# EAGLE design ESP32_VGA_Pocket (EAGLE 6.3)
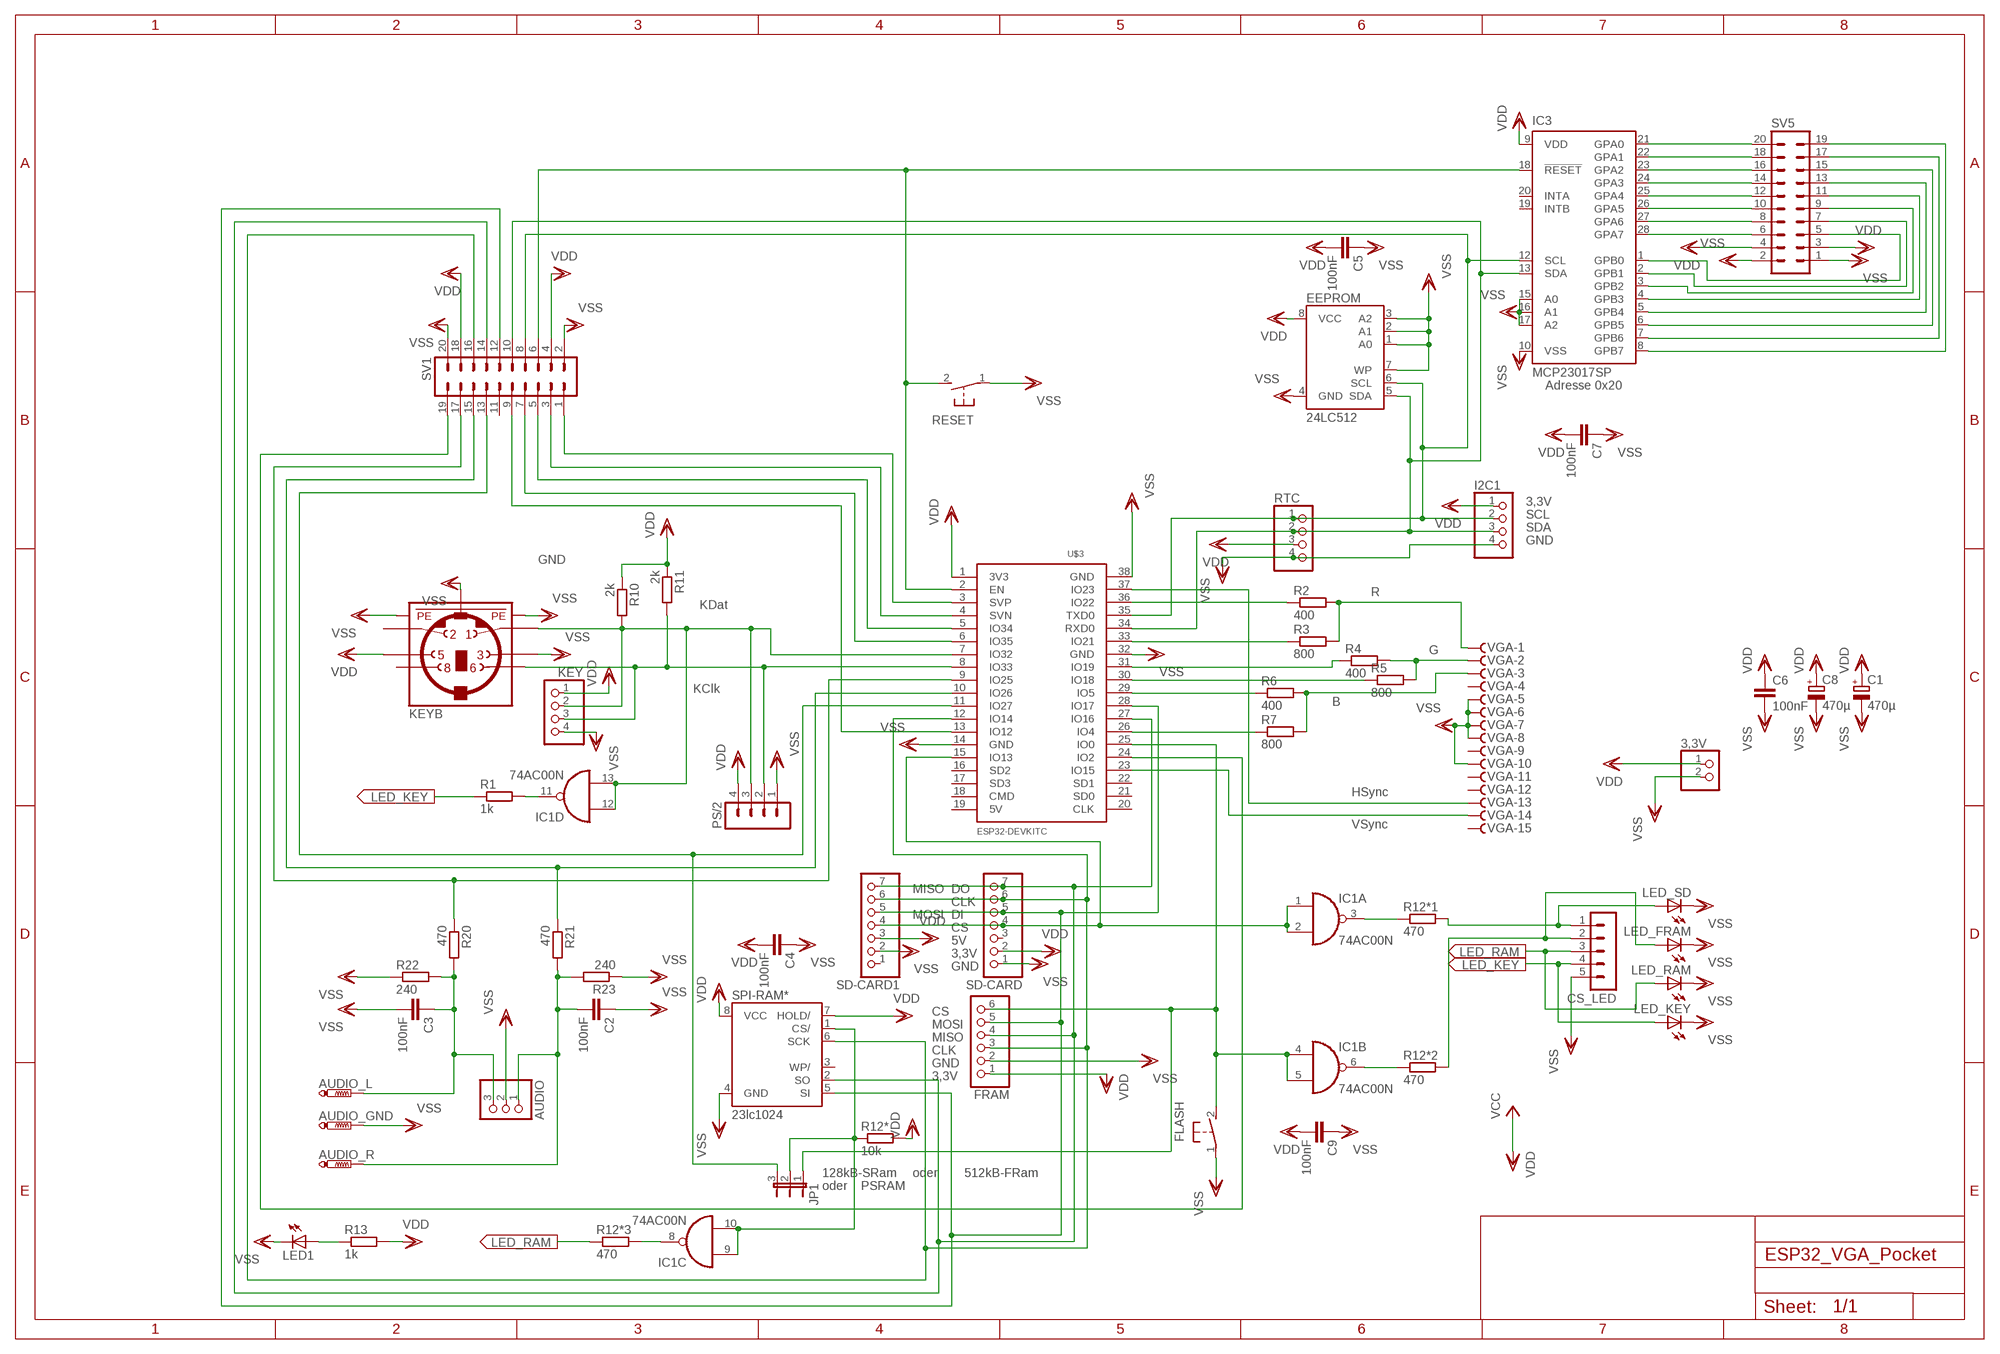
[diagram p0: schematic, sheet 1]

## Parts
3,3V  PINHD-1X2  [1X02]
AUDIO  PINHD-1X3  [1X03]
AUDIO_GND  PTR1PAD1-13Y  [P1-13Y]
AUDIO_L  PTR1PAD1-13Y  [P1-13Y]
AUDIO_R  PTR1PAD1-13Y  [P1-13Y]
C1  470µ  CPOL-EUE3.5-10  [E3,5-10]
C2  100nF  C-EU025-030X050  [C025-030X050]
C3  100nF  C-EU025-030X050  [C025-030X050]
C4  100nF  C-EU025-030X050  [C025-030X050]
C5  100nF  C-EU025-030X050  [C025-030X050]
C6  100nF  C-EU025-030X050  [C025-030X050]
C7  100nF  C-EU025-030X050  [C025-030X050]
C8  470µ  CPOL-EUE3.5-10  [E3,5-10]
C9  100nF  C-EU025-030X050  [C025-030X050]
CS_LED  MA05-1  [MA05-1]
EEPROM  24LC512  AT24CP  [DIL08]
FLASH  31-XX  [B3F-31XX]
FRAM  PINHD-1X6  [1X06]
I2C1  PINHD-1X4  [1X04]
IC1  74AC00N  [DIL14]
IC3  MCP23017SP  [DIL28-3]
JP1  JP2E  [JP2]
KEY  PINHD-1X4  [1X04]
KEYB  MINI_DIN_6  [M_DIN6]
LED1  LED5MM  [LED5MM]
LED_FRAM  LED5MM  [LED5MM]
LED_KEY  LED5MM  [LED5MM]
LED_RAM  LED5MM  [LED5MM]
LED_SD  LED5MM  [LED5MM]
PS/2  MA04-1  [MA04-1]
R1  1k  R-EU_0204/7  [0204/7]
R2  400  R-EU_0204/7  [0204/7]
R3  800  R-EU_0204/7  [0204/7]
R4  400  R-EU_0204/7  [0204/7]
R5  800  R-EU_0204/7  [0204/7]
R6  400  R-EU_0204/7  [0204/7]
R7  800  R-EU_0204/7  [0204/7]
R10  2k  R-EU_0204/7  [0204/7]
R11  2k  R-EU_0204/7  [0204/7]
R12*  10k  R-EU_0204/7  [0204/7]
R12*1  470  R-EU_0204/7  [0204/7]
R12*2  470  R-EU_0204/7  [0204/7]
R12*3  470  R-EU_0204/7  [0204/7]
R13  1k  R-EU_0204/7  [0204/7]
R20  470  R-EU_0204/7  [0204/7]
R21  470  R-EU_0204/7  [0204/7]
R22  240  R-EU_0204/7  [0204/7]
R23  240  R-EU_0204/7  [0204/7]
RESET  31-XX  [B3F-31XX]
RTC  PINHD-1X4  [1X04]
SD-CARD  PINHD-1X7  [1X07]
SD-CARD1  PINHD-1X7  [1X07]
SPI-RAM*  23lc1024  AT25P  [DIL08]
SV1  MA10-2  [MA10-2]
SV5  MA10-2  [MA10-2]
U$3  ESP32DEVKITC  [ESP32-DEVKITC]
VGA  F15HDHS  [HDF15H]

## Nets
AUDIO1: AUDIO.3 AUDIO_L.TP C3.1 R20.2 R22.2
AUDIO2: AUDIO.1 AUDIO_R.TP C2.2 R21.2 R23.2
CLK: FRAM.3 SD-CARD1.6 SD-CARD.6 SPI-RAM*.6(SCK) SV1.16 U$3.12(IO14)
CLK_K: KEY.3 KEYB.6 PS/2.2 R11.2 U$3.8(IO33)
CS_RAM: IC1.9(C:I0) IC1.10(C:I1) JP1.2 R12*.1 SPI-RAM*.1(CS/)
CS_SD: IC1.1(A:I0) IC1.2(A:I1) SD-CARD1.4 SD-CARD.4 U$3.15(IO13)
DAT_K: IC1.12(D:I0) IC1.13(D:I1) KEY.2 KEYB.1 PS/2.3 R10.2 U$3.7(IO32)
FLASH: FLASH.2(S) FRAM.6 IC1.4(B:I0) IC1.5(B:I1) JP1.1 U$3.25(IO0)
IO2: SV1.19 U$3.24(IO2)
IO12: SV1.9 U$3.13(IO12)
IO27: JP1.3 SV1.13 U$3.11(IO27)
IO34: SV1.5 U$3.5(IO34)
IO35: SV1.7 U$3.6(IO35)
IO36: SV1.1 U$3.3(SVP)
IO39: SV1.3 U$3.4(SVN)
LED_FRAM: CS_LED.2 LED_FRAM.A R12*2.2
LED_KEY: CS_LED.4 LED_KEY.A R1.1
LED_RAM: CS_LED.3 LED_RAM.A R12*3.1
LED_SD: CS_LED.1 LED_SD.A R12*1.2
MISO: FRAM.4 SD-CARD1.7 SD-CARD.7 SPI-RAM*.2(SO) SV1.14 U$3.27(IO16)
MOSI: FRAM.5 SD-CARD1.5 SD-CARD.5 SPI-RAM*.5(SI) SV1.12 U$3.28(IO17)
N$1: R20.1 SV1.17 U$3.9(IO25)
N$2: IC1.3(A:O) R12*1.1
N$3: R21.1 SV1.15 U$3.10(IO26)
N$4: IC1.11(D:O) R1.2
N$5: IC1.6(B:O) R12*2.1
N$6: IC1.8(C:O) R12*3.2
N$7: LED1.A R13.1
N$8: IC3.1(GPB0) SV5.5
N$9: IC3.21(GPA0) SV5.20
N$10: IC3.22(GPA1) SV5.18
N$11: IC3.23(GPA2) SV5.16
N$12: IC3.24(GPA3) SV5.14
N$13: IC3.25(GPA4) SV5.12
N$14: IC3.26(GPA5) SV5.10
N$15: IC3.27(GPA6) SV5.8
N$16: IC3.28(GPA7) SV5.6
N$17: IC3.2(GPB1) SV5.7
N$18: IC3.3(GPB2) SV5.9
N$19: IC3.4(GPB3) SV5.11
N$20: IC3.5(GPB4) SV5.13
N$21: IC3.6(GPB5) SV5.15
N$22: IC3.7(GPB6) SV5.17
N$23: IC3.8(GPB7) SV5.19
N$41: R6.2 R7.2 VGA.3
N$42: R4.2 R5.2 VGA.2
N$43: R2.2 R3.2 VGA.1
N$44: R2.1 U$3.36(IO22)
N$45: R3.1 U$3.33(IO21)
N$46: R4.1 U$3.31(IO19)
N$47: R5.1 U$3.30(IO18)
N$48: R6.1 U$3.29(IO5)
N$49: R7.1 U$3.26(IO4)
N$50: U$3.37(IO23) VGA.13
N$51: U$3.23(IO15) VGA.14
RESET: IC3.18(!RESET) RESET.2(S) SV1.6 U$3.2(EN)
SCL: EEPROM.6(SCL) I2C1.2 IC3.12(SCL) RTC.1 SV1.8 U$3.35(TXD0)
SDA: EEPROM.5(SDA) I2C1.3 IC3.13(SDA) RTC.2 SV1.10 U$3.34(RXD0)
VDD [Power]: 3,3V.1 C1.+ C4.2 C5.2 C6.1 C7.2 C8.+ C9.2 EEPROM.8(VCC) FRAM.1 I2C1.1 IC3.9(VDD) KEY.1 KEYB.5 PS/2.4 R10.1 R11.1 R12*.2 R13.2 RTC.3 SD-CARD1.3 SD-CARD.2 SPI-RAM*.7(HOLD/) SPI-RAM*.8(VCC) SV1.4 SV1.18 SV5.3 SV5.4 U$3.1(3V3) ; supply symbol labelled VCC
VSS: 3,3V.2 AUDIO.2 AUDIO_GND.TP C1.- C2.1 C3.2 C4.1 C5.1 C6.2 C7.1 C8.- C9.1 CS_LED.5 EEPROM.1(A0) EEPROM.2(A1) EEPROM.3(A2) EEPROM.4(GND) EEPROM.7(WP) FLASH.1(P) FRAM.2 I2C1.4 IC3.10(VSS) IC3.15(A0) IC3.16(A1) IC3.17(A2) KEY.4 KEYB.3 KEYB.SH1(PE1) KEYB.SH2(PE2) KEYB.SH3(PE3) LED1.K(C) LED_FRAM.K(C) LED_KEY.K(C) LED_RAM.K(C) LED_SD.K(C) PS/2.1 R22.1 R23.1 RESET.1(P) RTC.4 SD-CARD1.2 SD-CARD.1 SPI-RAM*.4(GND) SV1.2 SV1.20 SV5.1 SV5.2 U$3.14(GND) U$3.32(GND) U$3.38(GND) VGA.5 VGA.6 VGA.7 VGA.8 VGA.10
Unconnected: IC3.19(INTB) IC3.20(INTA) KEYB.2 KEYB.8 SD-CARD1.1 SD-CARD.3 SPI-RAM*.3(WP/) SV1.11 U$3.16(SD2) U$3.17(SD3) U$3.18(CMD) U$3.19(5V) U$3.20(CLK) U$3.21(SD0) U$3.22(SD1) VGA.4 VGA.9 VGA.11 VGA.12 VGA.15

## Notes on the sheet
- Adresse 0x20
- 3,3V
- SCL
- SDA
- GND
- GND
- R
- KDat
- G
- KClk
- B
- HSync
- VSync
- MISO | DO
- CLK
- MOSI | DI
- CS
- 5V
- 3,3V
- GND
- CS
- MOSI
- MISO
- CLK
- GND
- 3,3V
- 128kB-SRam | oder | 512kB-FRam
- oder | PSRAM

## Power pins joined to a net without a drawn wire
GND: IC1.7(P:GND)
VDD: IC1.14(P:VCC)

## Library data of the parts
3,3V = pinhead:PINHD-1X2: PIN HEADER
AUDIO = pinhead:PINHD-1X3: PIN HEADER
AUDIO_GND AUDIO_L AUDIO_R = testpad:PTR1: TEST PIN
C1 C8 = rcl:CPOL-EU: POLARIZED CAPACITOR, European symbol
C2-C7 C9 = rcl:C-EU: CAPACITOR, European symbol
CS_LED = con-lstb:MA05-1: PIN HEADER; OC_FARNELL: unknown; OC_NEWARK: unknown
EEPROM = atmel:AT24C*: 2-wire serial EEPROM; MPN: AT24C1024BW-SH-B; OC_FARNELL: 1362646; OC_NEWARK: 03P2044
FLASH RESET = switch-omron:31-XX: OMRON SWITCH; MPN: B3F-3100; OC_FARNELL: 959704; OC_NEWARK: 36M3582
FRAM = pinhead:PINHD-1X6: PIN HEADER
I2C1 KEY RTC = pinhead:PINHD-1X4: PIN HEADER
IC1 = 74xx-eu:74*00: Quad 2-input NAND gate
IC3 = microchip:MCP23017: http://ww1.microchip.com/downloads/en/DeviceDoc/21952a.pdf Source: http://ww1.microchip.com/downloads/en/DeviceDoc/21952a.pdf; MF: MICROCHIP; MPN: MCP23017-E/SO; OC_FARNELL: 1332087; OC_NEWARK: 31K2958
JP1 = jumper:JP2E: JUMPER
KEYB = mini_din:MINI_DIN_6
LED1 LED_FRAM LED_KEY LED_RAM LED_SD = led:LED: LED OSRAM: - CHIPLED LG R971, LG N971, LY N971, LG Q971, LY Q971, LO R971, LY R971 LH N974, LH R974 LS Q976, LO Q976, LY Q976 LO Q996 - Hyper CHIPLED LW Q18S LB Q993, LB Q99A, LB R99A - SideLED LS A670, LO A670, LY A670, LG A670, LP A670 LB A673, LV A673, LT A673, LW A673 LH A674 LY A675 LS A676, LA A676, LO A676, LY A676, LW A676 LS A679, LY A679, LG A679 - Hyper Micro SIDELED® LS Y876, LA Y876, LO Y876, LY Y876 LT Y87S - SmartLED LW L88C, LW L88S LB L89C, LB L89S, LG L890 LS L89K, LO L89K, LY L89K LS L896, LA L896, LO L896, LY L896 - TOPLED LS T670, LO T670, LY T670, LG T670, LP T670 LSG T670, LSP T670, LSY T670, LOP T670, LYG T670 LG T671, LOG T671, LSG T671 LB T673, LV T673, LT T673, LW T673 LH T674 LS T676, LA T676, LO T676, LY T676, LB T676, LH T676, LSB T676, LW T676 LB T67C, LV T67C, LT T67C, LS T67K, LO T67K, LY T67K, LW E67C LS E67B, LA E67B, LO E67B, LY E67B, LB E67C, LV E67C, LT E67C LW T67C LS T679, LY T679, LG T679 LS T770, LO T770, LY T770, LG T770, LP T770 LB T773, LV T773, LT T773, LW T773 LH T774 LS E675, LA E675, LY E675, LS T675 LS T776, LA T776, LO T776, LY T776, LB T776 LHGB T686 LT T68C, LB T68C - Hyper Mini TOPLED® LB M676 - Mini TOPLED Santana® LG M470 LS M47K, LO M47K, LY M47K Source: http://www.osram.convergy.de LUXEON: - LUMILED® LXK2-PW12-R00, LXK2-PW12-S00, LXK2-PW14-U00, LXK2-PW14-V00 LXK2-PM12-R00, LXK2-PM12-S00, LXK2-PM14-U00 LXK2-PE12-Q00, LXK2-PE12-R00, LXK2-PE12-S00, LXK2-PE14-T00, LXK2-PE14-U00 LXK2-PB12-K00, LXK2-PB12-L00, LXK2-PB12-M00, LXK2-PB14-N00, LXK2-PB14-P00, LXK2-PB14-Q00 LXK2-PR12-L00, LXK2-PR12-M00, LXK2-PR14-Q00, LXK2-PR14-R00 LXK2-PD12-Q00, LXK2-PD12-R00, LXK2-PD12-S00 LXK2-PH12-R00, LXK2-PH12-S00 LXK2-PL12-P00, LXK2-PL12-Q00, LXK2-PL12-R00 Source: www.luxeon.com KINGBRIGHT: KA-3528ASYC Source: www.kingbright.com
PS/2 = con-lstb:MA04-1: PIN HEADER; OC_FARNELL: unknown; OC_NEWARK: unknown
R1-R7 R10 R11 R12* R12*1-R12*3 R13 R20-R23 = rcl:R-EU_: RESISTOR, European symbol
SD-CARD SD-CARD1 = pinhead:PINHD-1X7: PIN HEADER
SPI-RAM* = atmel:AT25*: SPI bus serial EEPROM; MPN: CAT25040LI-G; OC_FARNELL: 1718045; OC_NEWARK: 06R0588
SV1 SV5 = con-lstb:MA10-2: PIN HEADER; OC_FARNELL: unknown; OC_NEWARK: unknown
U$3 = ESP32-DEVKITC:ESP32DEVKITC
VGA = con-subd:F15?S: SUB-D; OC_FARNELL: unknown; OC_NEWARK: unknown

## Net classes
0 default: width 0.254 mm, clearance 0.254 mm
1 Power: width 0.635 mm, drill 0.61 mm, clearance 0.381 mm

## Board
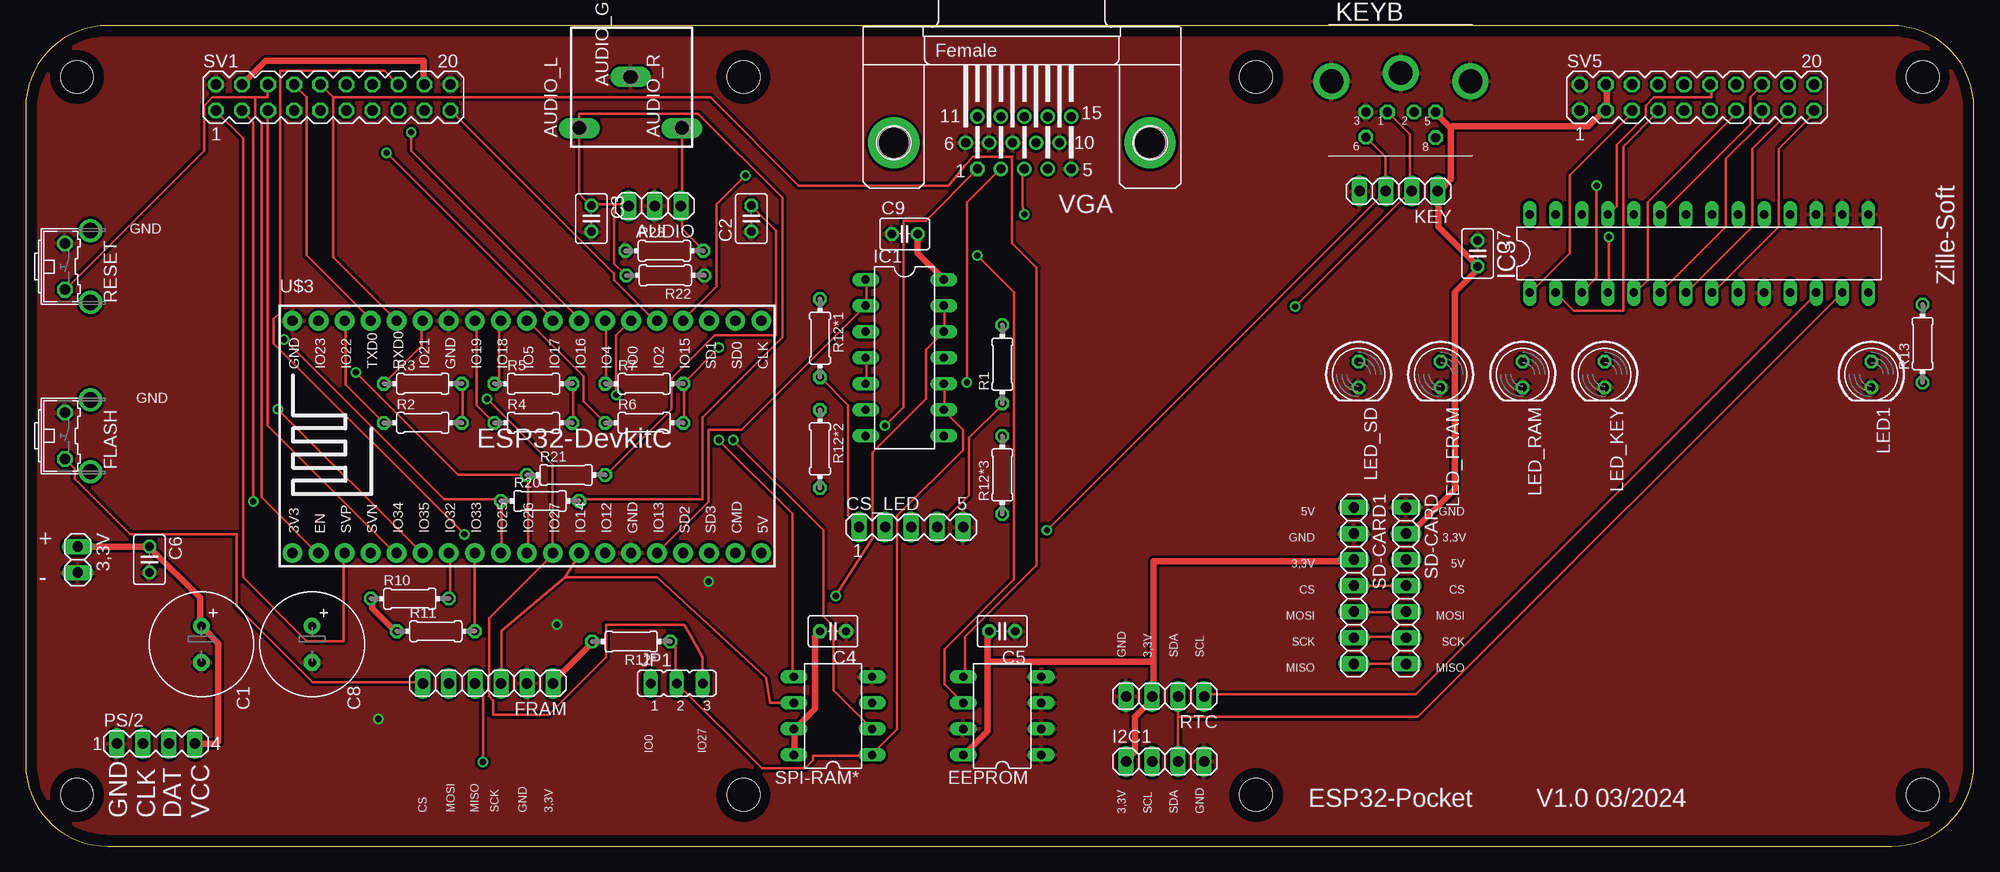
[diagram p1: board, top side]
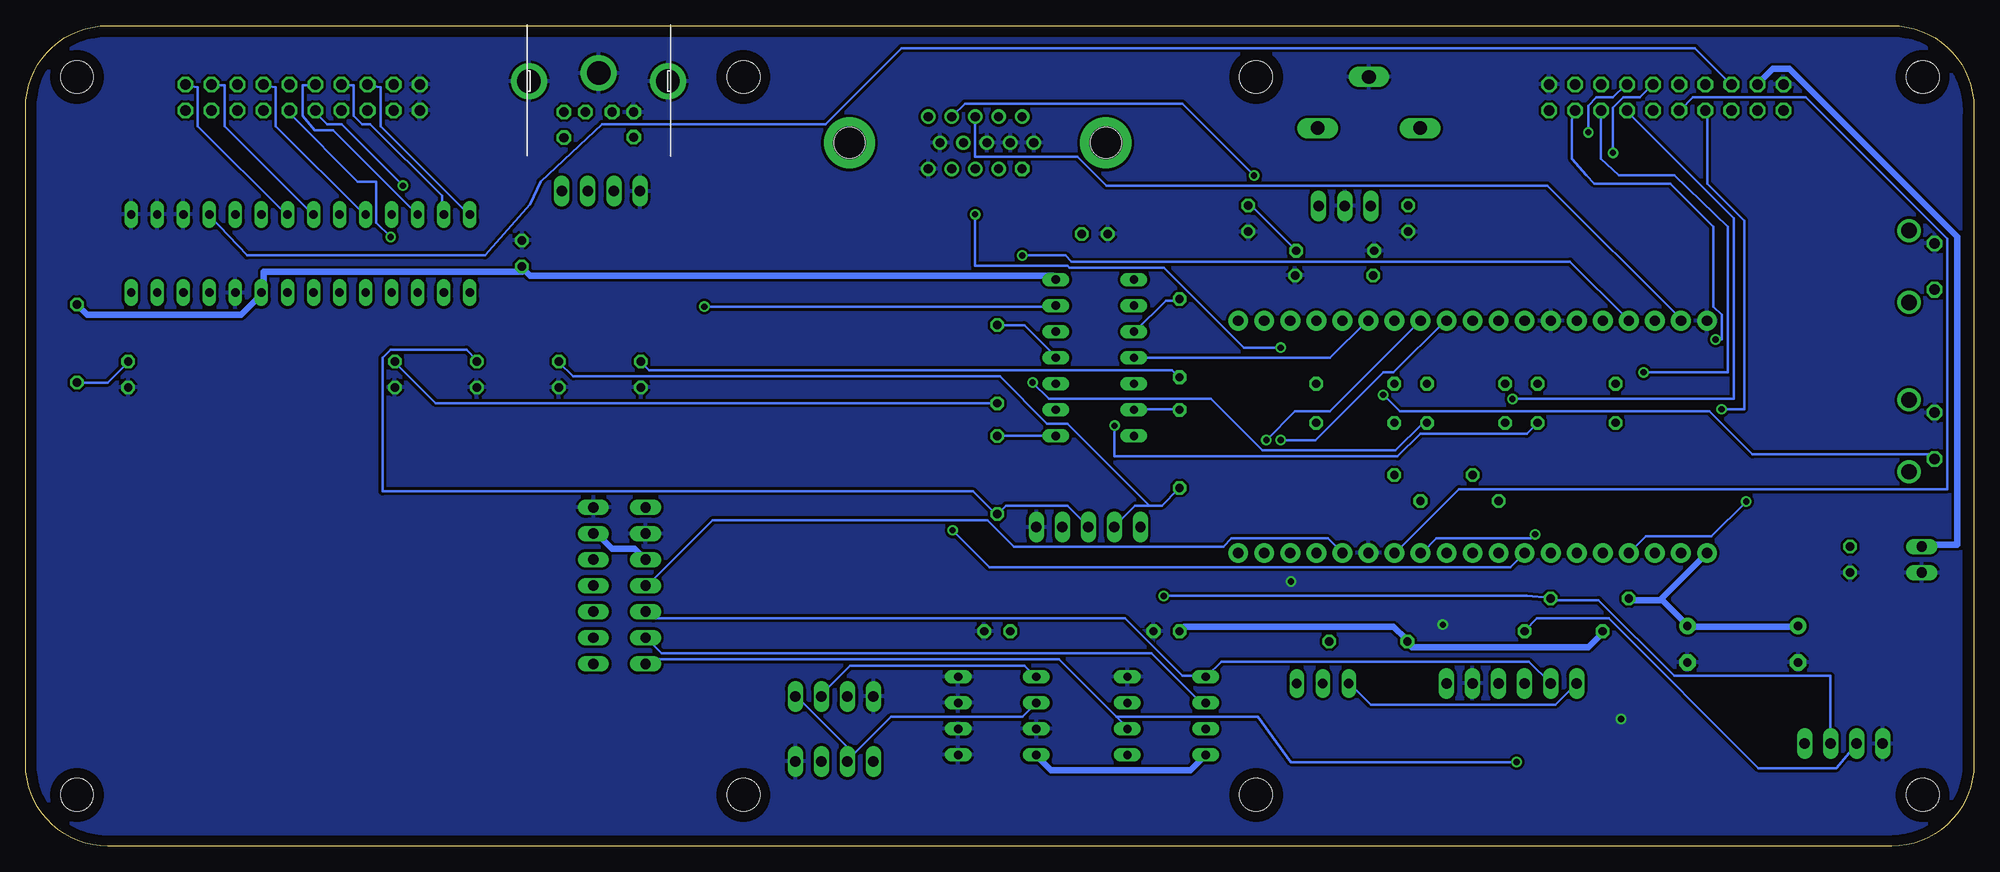
[diagram p2: board, bottom side, seen from below]

Size 190 x 80 mm. Coordinates in mm from the lower left corner, seen from the top.
Outline: 190,8 190,72 arc90 182,80 8,80 arc90 0,72 0,8 arc90 8,0 182,0 arc90 190,8
Copper layers (1*16): Top 0.035mm / dielectric 1.5mm / Bottom 0.035mm
Design rules "default": minimum track width 10mil, minimum drill 24mil, track to track 8mil, track to pad 8mil, pad to pad 8mil, via to via 8mil, smd to smd 8mil, copper to edge 40mil, drill to drill 8mil, minimum pad ring 10mil, minimum via ring 8mil, stop-mask expansion 4mil, vias tented up to drill 0mil, thermal gap 10mil
Holes 3.2 mm at 5,75 5,5 185,5 185,75 70,5 120,5 120,75 70,75

### Footprints (pad centres in the part's own frame; a part is rotated, then mirrored left to right if it is on the bottom)
1X02 = drill 1.016 long: 1 -1.27,0; 2 1.27,0
1X03 = drill 1.016 long: 1 -2.54,0; 2 0,0; 3 2.54,0
P1-13Y = drill 1.321 pad 1.905 long: TP 0,0
E3,5-10 = drill 0.813 pad 1.6: + -1.778,0 | drill 0.813 pad 1.6 octagon: - 1.778,0
C025-030X050 = drill 0.813 octagon: 1 -1.27,0; 2 1.27,0
MA05-1 = drill 1.016 long: 1 -5.08,0; 2 -2.54,0; 3 0,0; 4 2.54,0; 5 5.08,0
DIL08 = drill 0.813 long: 1 -3.81,-3.81; 2 -1.27,-3.81; 3 1.27,-3.81; 4 3.81,-3.81; 5 3.81,3.81; 6 1.27,3.81; 7 -1.27,3.81; 8 -3.81,3.81
B3F-31XX = drill 1.016 octagon: 1 -2.261,-1.245; 2 2.261,-1.245 | drill 1.499 pad 2.159: 3 -3.505,1.245; 4 3.505,1.245
1X06 = drill 1.016 long: 1 -6.35,0; 2 -3.81,0; 3 -1.27,0; 4 1.27,0; 5 3.81,0; 6 6.35,0
1X04 = drill 1.016 long: 1 -3.81,0; 2 -1.27,0; 3 1.27,0; 4 3.81,0
DIL14 = drill 0.813 long: 1 -7.62,-3.81; 2 -5.08,-3.81; 3 -2.54,-3.81; 4 0,-3.81; 5 2.54,-3.81; 6 5.08,-3.81; 7 7.62,-3.81; 8 7.62,3.81; 9 5.08,3.81; 10 2.54,3.81; 11 0,3.81; 12 -2.54,3.81; 13 -5.08,3.81; 14 -7.62,3.81
DIL28-3 = drill 0.813 long: 1 -16.51,-3.81; 2 -13.97,-3.81; 3 -11.43,-3.81; 4 -8.89,-3.81; 5 -6.35,-3.81; 6 -3.81,-3.81; 7 -1.27,-3.81; 8 1.27,-3.81; 9 3.81,-3.81; 10 6.35,-3.81; 11 8.89,-3.81; 12 11.43,-3.81; 13 13.97,-3.81; 14 16.51,-3.81; 15 16.51,3.81; 16 13.97,3.81; 17 11.43,3.81; 18 8.89,3.81; 19 6.35,3.81; 20 3.81,3.81; 21 1.27,3.81; 22 -1.27,3.81; 23 -3.81,3.81; 24 -6.35,3.81; 25 -8.89,3.81; 26 -11.43,3.81; 27 -13.97,3.81; 28 -16.51,3.81
JP2 = drill 0.914 long: 1 -2.54,0; 2 0,0; 3 2.54,0
M_DIN6 = drill 0.9 pad 1.422 octagon: 1 -1.3,-3.75; 2 1.3,-3.75; 3 -3.4,-3.75; 5 3.4,-3.75; 6 -3.4,-6.2; 8 3.4,-6.25 | drill 2.3 pad 3.5: SH1 6.8,-0.75; SH2 0,0.05; SH3 -6.75,-0.75
LED5MM = drill 0.813 octagon: A -1.27,0; K 1.27,0
MA04-1 = drill 1.016 long: 1 -3.81,0; 2 -1.27,0; 3 1.27,0; 4 3.81,0
0204/7 = drill 0.813 octagon: 1 -3.81,0; 2 3.81,0
1X07 = drill 1.016 long: 1 -7.62,0; 2 -5.08,0; 3 -2.54,0; 4 0,0; 5 2.54,0; 6 5.08,0; 7 7.62,0
MA10-2 = drill 1.016 octagon: 1 -11.43,-1.27; 2 -11.43,1.27; 3 -8.89,-1.27; 4 -8.89,1.27; 5 -6.35,-1.27; 6 -6.35,1.27; 7 -3.81,-1.27; 8 -3.81,1.27; 9 -1.27,-1.27; 10 -1.27,1.27; 11 1.27,-1.27; 12 1.27,1.27; 13 3.81,-1.27; 14 3.81,1.27; 15 6.35,-1.27; 16 6.35,1.27; 17 8.89,-1.27; 18 8.89,1.27; 19 11.43,-1.27; 20 11.43,1.27
ESP32-DEVKITC = drill 1 pad 1.93: 1 -22.87,-11.42; 2 -20.33,-11.42; 3 -17.79,-11.42; 4 -15.25,-11.42; 5 -12.71,-11.42; 6 -10.17,-11.42; 7 -7.63,-11.42; 8 -5.09,-11.42; 9 -2.55,-11.42; 10 -0.01,-11.42; 11 2.53,-11.42; 12 5.07,-11.42; 13 7.61,-11.42; 14 10.15,-11.42; 15 12.69,-11.42; 16 15.23,-11.42; 17 17.77,-11.42; 18 20.31,-11.42; 19 22.85,-11.42; 20 22.85,11.23; 21 20.31,11.23; 22 17.77,11.23; 23 15.23,11.23; 24 12.69,11.23; 25 10.15,11.23; 26 7.61,11.23; 27 5.07,11.23; 28 2.53,11.23; 29 -0.01,11.23; 30 -2.55,11.23; 31 -5.09,11.23; 32 -7.63,11.23; 33 -10.17,11.23; 34 -12.71,11.23; 35 -15.25,11.23; 36 -17.79,11.23; 37 -20.33,11.23; 38 -22.87,11.23
HDF15H = drill 0.9 octagon: 1 4.329,2.54 | drill 0.9: 2 2.043,2.54; 3 -0.243,2.54; 4 -2.529,2.54; 5 -4.815,2.54; 6 5.472,0; 7 3.186,0; 8 0.9,0; 9 -1.386,0; 10 -3.672,0; 11 4.329,-2.54; 12 2.043,-2.54; 13 -0.243,-2.54; 14 -2.529,-2.54; 15 -4.815,-2.54 | drill 3.2 pad 5: VSS -12.5,0; VSS1 12.5,0 | hole 3: -12.5,0; 12.5,0

### Placement (x,y rotation side)
3,3V  5.08,27.94 270 top
AUDIO  61.36,62.43 180 top
AUDIO_GND  59,75 90 top
AUDIO_L  54,70 90 top
AUDIO_R  64,70 90 top
C1  17.14,19.68 270 top
C2  70.77,61.19 90 top
C3  55.17,61.19 270 top
C4  78.74,20.95 180 top
C5  95.25,20.95 180 top
C6  12.06,27.94 270 top
C7  141.6,57.78 270 top
C8  27.94,19.68 270 top
C9  85.72,59.69 0 top
CS_LED  86.36,31.11 0 top
EEPROM  95.25,12.7 90 top
FLASH  5.08,40.01 270 top
FRAM  45.09,15.88 180 top
I2C1  111.12,8.26 0 top
IC1  85.72,47.62 270 top
IC3  163.19,57.78 0 top
JP1  63.5,15.88 0 top
KEY  133.91,63.87 180 top
KEYB  134.1,75.33 0 top
LED1  180,46 270 top
LED_FRAM  138,46 270 top
LED_KEY  154,46 270 top
LED_RAM  146,46 270 top
LED_SD  130,46 270 top
PS/2  12.7,10 0 top
R1  95.25,46.99 90 top
R2  38.73,41.27 0 top
R3  38.73,45.09 0 top
R4  49.53,41.27 0 top
R5  49.53,45.09 0 top
R6  60.33,41.27 0 top
R7  60.33,45.09 0 top
R10  37.47,24.13 0 top
R11  40.01,20.95 0 top
R12*  59.05,19.95 180 top
R12*1  77.47,49.53 270 top
R12*2  77.47,38.73 270 top
R12*3  95.25,36.2 90 top
R13  185,49 90 top
R20  50.16,33.66 0 top
R21  52.7,36.2 0 top
R22  62.39,55.65 180 top
R23  62.29,58.05 0 top
RESET  5.08,56.52 270 top
RTC  111.12,14.61 180 top
SD-CARD  134.62,25.4 270 top
SD-CARD1  129.54,25.4 270 top
SPI-RAM*  78.74,12.7 90 top
SV1  30,73 0 top
SV5  163,73 0 top
U$3  48.9,40.01 0 top
VGA  97.16,68.58 180 top

### Tracks (layer width: path | path; a pad name or v marks a point on that pad's centre or on a via)
AUDIO1
  Top 0.254: 57.4,62.6 58.8,62.6 AUDIO.3 | 57.4,62.6 55.2,62.6 C3.1 55,62.6 54,63.6 AUDIO_L.TP 54,71.4 65.6,71.4 73.8,63.2 73.8,49.6 66,41.8 66,33.8 54,33.8 R20.2 | 57.4,62.6 57.4,56.8 58.4,55.8 R22.2
AUDIO2
  Top 0.254: R23.2 66,58.2 64,60.2 64,62.4 AUDIO.1 64,62.6 AUDIO_R.TP | R21.2 56.6,36.2 63,42.6 63,45.6 67.2,49.8 73.2,49.8 73.2,60 70.8,62.4 C2.2
  Bottom 0.254: R23.2 66.2,58.2 70.4,62.4 70.6,62.4 C2.2
CLK  (via drill 0.61)
  Top 0.254: SD-CARD1.6 129.6,20.4 134.6,20.4 SD-CARD.6 | 52.6,26.2 61.6,26.2 72.2,16.4 72.6,14 74.8,14 SPI-RAM*.6 | 52.6,26.2 54,28.4 U$3.12 | 52.6,26.2 46.4,21 46.4,16 FRAM.3 | v42.8,30.4 24.2,49 24.2,51.4 24.8,52 24.8,75.6 35,75.6 36.2,74.4 SV1.16
  Bottom 0.254: v42.8,30.4 43.2,30 52.4,30 53.8,28.6 U$3.12 | SD-CARD1.6 129.4,20.2 128,18.8 80.2,18.8 75.4,14 75,14 SPI-RAM*.6
CLK_K  (via drill 0.61)
  Top 0.254: KEYB.6 130.8,69 132.6,67.2 132.6,64 KEY.3 132.6,63.8 v99.6,30.8 | R11.2 43.8,21 43.8,28.4 U$3.8
  Bottom 0.254: PS/2.2 11.4,10 13.4,7.6 21,7.6 35.6,22.2 42.6,22.2 43.8,21 R11.2 | v99.6,30.8 96,27.2 45.2,27.2 44,28.4 U$3.8
CS_RAM
  Top 0.254: IC1.10 89.6,45 89.6,42.6 IC1.9 89.6,42.4 91.4,40.6 91.4,38.6 85,32.2 85,11.4 82.6,9 SPI-RAM*.1 82.4,8.8 76.8,8.8 76.8,8.4 76,7.6 71.8,7.6 63.6,15.8 JP1.2 63.4,16 63.4,19.4 63,19.8 R12*.1
CS_SD
  Top 0.254: SD-CARD.4 SD-CARD1.4 | IC1.1 82,55.2 82,52.8 IC1.2 81.8,52.6 69.8,40.6 66.6,40.6 66.6,33.6 U$3.15
  Bottom 0.254: U$3.15 63,30 72.4,30 73.2,29.2 93.6,29.2 96.2,31.8 123,31.8 129.4,25.4 SD-CARD1.4
DAT_K  (via drill 0.61)
  Top 0.254: R10.2 41.4,24.2 41.4,28.4 U$3.7 | IC1.13 89.6,52.6 89.6,50.2 IC1.12 89.4,50 87.8,48.4 87.8,43.6 82.6,38.4 82.6,30 v79,24.4 | KEYB.1 133,71.4 135,69.4 135,64 KEY.2 135,63.8 v123.8,52.6
  Bottom 0.254: PS/2.3 14,10 14,16.6 29.2,16.6 36.6,24 41.2,24 R10.2 41.4,24.2 43.6,24.4 v79,24.4 | v123.8,52.6 89.6,52.6 IC1.13
FLASH  (via drill 0.61)
  Top 0.254: IC1.5 82,45.2 82,47.6 IC1.4 | FLASH.2 4,37.6 4.8,36.8 4.8,35.8 10.2,30.4 20.6,30.4 20.6,23.4 28,16 38.6,16 FRAM.6 | v57.6,44 57.6,49.8 59,51.2 U$3.25
  Bottom 0.254: IC1.4 81.8,47.6 62.8,47.6 59.2,51.2 U$3.25 | JP1.1 60.8,15.8 58.8,13.8 40.8,13.8 38.8,15.8 FRAM.6 | v57.6,44 56,42.4 25.8,42.4 21.6,38.2 4.4,38.2 4,37.8 FLASH.2
IO2
  Top 0.254: SV1.19 41.6,71.6 57.4,55.8 57.4,55.2 61.4,51.2 U$3.24
IO12
  Bottom 0.254: SV1.9 28.6,71.8 27.4,73 16.4,73 2.6,59.2 2.6,34.8 50.2,34.8 56.4,28.6 U$3.13
IO27  (via drill 0.61)
  Top 0.254: JP1.3 66,16 66,18.4 64.8,20.6 64.2,21.6 56.6,21.6 56.6,18.4 51,12.8 45.6,12.8 45.6,14.2 45.2,14.6 45.2,22.2 51.4,28.4 U$3.11 51.4,28.6 51.4,37.2 v45,43.6
  Bottom 0.254: v45,43.6 23.4,43.6 23.4,61.2 33.8,71.6 SV1.13
IO34
  Top 0.254: SV1.5 23.6,71.6 23.6,41 36,28.6 U$3.5
IO35  (via drill 0.61)
  Top 0.254: v24.6,42.6 38.6,28.6 U$3.6
  Bottom 0.254: v24.6,42.6 22.4,42.6 22.4,61 26,64.6 26,71.6 SV1.7
IO36
  Top 0.254: SV1.1 18.6,71.6 21.2,69 21.2,26.2 27.4,20 31,20 31,28.4 U$3.3
IO39  (via drill 0.61)
  Top 0.254: v22.2,33.6 22.2,70.6 21.2,71.6 SV1.3
  Bottom 0.254: v22.2,33.6 25.6,30.2 32,30.2 33.6,28.6 U$3.4
LED_FRAM
  Bottom 0.254: 80.4,33.2 81.8,33.2 83.8,31.2 CS_LED.2 | 80.4,33.2 79.2,33.2 77.6,34.8 R12*2.2 | 80.4,33.2 88.4,41.2 90.4,41.2 95,45.8 136.6,45.8 138,47.2 LED_FRAM.A
LED_KEY
  Top 0.254: R1.1 95.2,43 92,39.8 92,34.2 89,31.2 CS_LED.4
  Bottom 0.254: LED_KEY.A 154,47.2 150,43.2 95.4,43.2 R1.1
LED_RAM
  Bottom 0.254: CS_LED.3 86.4,31.2 88.4,33.2 94.4,33.2 95.2,32.4 R12*3.1 95.4,32.4 97.6,34.6 155.2,34.6 155.2,47.6 154.4,48.4 147,48.4 146,47.4 LED_RAM.A
LED_SD
  Top 0.254: R12*1.2 77.6,45.6 80.2,43 80.2,32.2 81.2,31.2 CS_LED.1
  Bottom 0.254: LED_SD.A 130,47.2 129.2,46.4 78.2,46.4 77.6,45.8 R12*1.2
MISO  (via drill 0.61)
  Top 0.254: v37.6,69.6 37.6,67.8 53.8,51.6 53.8,51.4 U$3.27 | v44.6,8.2 44.6,15.2 44,15.8 FRAM.4 | SD-CARD.7 134.6,17.8 129.6,17.8 SD-CARD1.7 | v69,39.6 77.8,30.8 77.8,22.4 78.8,21.4 78.8,15.2 82.4,11.6 SPI-RAM*.2
  Bottom 0.254: v37.6,69.6 37.6,72.2 36.8,73 35.2,73 34,74.2 SV1.14 | 83.6,12.6 89.2,18.2 129,18.2 129.4,17.8 SD-CARD1.7 | 83.6,12.6 82.6,11.6 SPI-RAM*.2 | 83.6,12.6 69.8,12.6 66.6,8.2 v44.6,8.2 | U$3.27 62.8,42.4 66.2,42.4 v69,39.6
MOSI  (via drill 0.61)
  Top 0.254: v35.2,67.6 51.4,51.4 U$3.28 | SD-CARD1.5 129.6,22.8 134.6,22.8 SD-CARD.5 | v67.6,39.6 74.8,32.4 74.8,16.6 SPI-RAM*.5
  Bottom 0.254: v35.2,67.6 35.2,72 34.2,73 32.6,73 31.4,74.2 SV1.12 | FRAM.5 43.4,18 73.4,18 74.8,16.6 SPI-RAM*.5 75,16.6 77.2,16.6 82.8,22.2 128.8,22.2 129.4,22.8 SD-CARD1.5 | v67.6,39.6 64.2,39.6 57.6,46.2 56.6,46.2 51.6,51.2 U$3.28
N$1  (via drill 0.61)
  Top 0.254: U$3.9 46.4,28.6 46.4,33.6 R20.1 46.2,33.8 40.8,33.8 v25.2,49.4
  Bottom 0.254: v25.2,49.4 24.6,49.4 24.6,51.8 25.4,52.6 25.4,60.4 29.6,64.6 37,64.6 37.8,65.4 39.2,67 39.2,70.8 39,71.6 SV1.17
N$2
  Bottom 0.254: IC1.3 81.8,50.2 78.8,53.2 77.6,53.2 R12*1.1
N$3  (via drill 0.61)
  Top 0.254: U$3.10 49,28.6 49,36 R21.1 48.8,36.2 42.2,36.2 v32.2,46.2
  Bottom 0.254: v32.2,46.2 24,46.2 24,60.4 29.2,65.4 34.6,65.4 36.4,67 36.4,71.6 SV1.15
N$4
  Bottom 0.254: R1.2 92.6,50.8 89.6,47.8 IC1.11
N$5
  Bottom 0.254: R12*2.1 77.6,42.6 81.8,42.6 IC1.6
N$6
  Bottom 0.254: IC1.8 89.6,40 95.2,40 R12*3.2
N$7
  Bottom 0.254: LED1.A 180,47.2 182,45.2 R13.1
N$8
  Top 0.254: IC3.1 146.8,54 150.6,57.8 150.6,65.4 156.8,71.6 SV5.5
N$9
  Bottom 0.254: IC3.21 164.6,61.6 173.2,70.2 173.2,74 174.6,74.2 SV5.20
N$10
  Bottom 0.254: IC3.22 162,61.6 170.6,70.2 170.6,74.2 172,74.2 SV5.18
N$11
  Top 0.254: IC3.23 159.4,61.6 168.2,70.4 168.2,73 169.4,74.2 SV5.16
N$12
  Bottom 0.254: IC3.24 157,61.6 165.6,70.2 165.6,74 167,74.2 SV5.14
N$13
  Top 0.254: IC3.25 154.4,61.6 155.2,62.4 155.2,68.4 158,71.2 158,72.2 158.8,73 164.4,73 164.4,74.2 SV5.12
N$14
  Bottom 0.254: IC3.26 151.8,61.6 160,69.8 161.8,69.8 163,71.2 163,74.2 162,74.2 SV5.10
N$15
  Bottom 0.254: IC3.27 149.4,61.6 149.4,63.4 156.4,70.4 157.2,70.4 158,71.2 158,74.2 159.2,74.2 SV5.8
N$16
  Bottom 0.254: IC3.28 146.8,61.6 155.4,70.2 155.4,74 156.8,74.2 SV5.6
N$17
  Top 0.254: IC3.2 151,52.2 155.8,52.2 155.8,68.2 159.2,71.6 SV5.7
N$18  (via drill 0.61)
  Top 0.254: v153.2,64.4 153.2,55.4 151.8,54 IC3.3
  Bottom 0.254: v153.2,64.4 159.2,70.4 160.6,70.4 161.8,71.6 SV5.9
N$19  (via drill 0.61)
  Top 0.254: v154.4,59.4 154.4,54 IC3.4
  Bottom 0.254: v154.4,59.4 155.8,60.8 155.8,64.8 157.6,64.8 164.2,71.4 SV5.11
N$20
  Top 0.254: IC3.5 157,54 158.2,55.2 158.2,62.8 166.8,71.4 SV5.13
N$21
  Top 0.254: IC3.6 159.4,54 165.8,60.4 165.8,67 169.4,70.6 169.4,71.6 SV5.15
N$22
  Top 0.254: IC3.7 162,54 168.4,60.4 168.4,68 172,71.6 SV5.17
N$23
  Top 0.254: IC3.8 164.6,54 171,60.4 171,68 174.6,71.6 SV5.19
N$41  (via drill 0.6, 0.61)
  Top 0.254: R6.2 64.2,41.4 64.2,45 R7.2 64.2,45.2 v67.6,48.6 | v97.4,61.6 97.2,62.4 97.2,66 VGA.3
  Bottom 0.254: v97.4,61.6 97.4,56.6 88.4,56.6 88.2,56.4 79,56.4 71.2,48.6 v67.6,48.6
N$42  (via drill 0.61)
  Top 0.254: R4.2 53.4,41.4 53.4,45 R5.2 | v91.8,45.2 91.8,62.8 95,66 VGA.2
  Bottom 0.254: v91.8,45.2 90.2,43.6 74.4,43.6 69.4,38.6 56.4,38.6 53.8,41.2 53.4,41.2 R4.2
N$43  (via drill 0.61)
  Top 0.254: R2.2 42.6,41.4 42.6,45 R3.2 | v83.8,41 85.6,42.8 85.6,61 87.8,61 92.8,66 VGA.1
  Bottom 0.254: v83.8,41 83.8,38 56.2,38 54,40.2 43.6,40.2 42.6,41.2 R2.2
N$44
  Top 0.254: R2.1 31.2,45 31.2,51.2 U$3.36
N$45
  Top 0.254: R3.1 35,45.2 38.6,48.8 38.6,51.2 U$3.33
N$46
  Top 0.254: R4.1 45.6,41.4 44,43 44,51.2 U$3.31
N$47
  Top 0.254: R5.1 45.8,45.2 46.2,45.6 46.2,51.2 U$3.30
N$48
  Top 0.254: R6.1 56.4,41.4 54.4,43.4 54.4,45.8 49,51.2 U$3.29
N$49
  Top 0.254: R7.1 56.6,45.2 56.6,51.2 U$3.26
N$50
  Bottom 0.254: VGA.13 97.4,71 97.4,67.2 87.4,67.2 84.6,64.4 41.6,64.4 28.6,51.4 U$3.37
N$51  (via drill 0.61)
  Top 0.254: v70.2,65.4 67.4,62.6 67.4,54.6 64.2,51.4 U$3.23
  Bottom 0.254: v70.2,65.4 77.2,72.4 98.4,72.4 99.6,71.2 VGA.14
RESET
  Top 0.254: 22.4,73 23.6,73 23.6,74.2 SV1.6 | 22.4,73 18.2,73 17.4,72.2 17.4,67.8 4,54.4 RESET.2 | 22.4,73 22.4,71.2 23,70.6 23,34 28.4,28.6 U$3.2
  Bottom 0.254: IC3.18 172,61.4 168.4,57.6 145.2,57.6 140.8,62.6 139.8,64.8 133.8,70.4 112,70.4 104.6,77.8 27.2,77.8 23.8,74.4 SV1.6
SCL  (via drill 0.61)
  Top 0.254: SV1.8 26.2,74.2 27.4,73 27.4,57.6 33.6,51.4 U$3.35 | IC3.12 174.6,53.8 135.6,14.8 115,14.8 RTC.1 | v92.8,57.6 96.4,54 96.4,26 89.6,19.2 89.6,15.8 91.4,14 EEPROM.6
  Bottom 0.254: 109.2,9 109.8,8.4 I2C1.2 109.2,9 | 109.2,9 105.6,12.6 92.8,12.6 91.6,13.8 EEPROM.6 | 109.2,9 114.8,14.6 RTC.1 | v92.8,57.6 88.6,57.6 88,57 39.4,57 33.8,51.4 U$3.35
SDA
  Top 0.254: 30,73 SV1.10 | 30,73 30,57.4 36,51.4 U$3.34 | 112.4,12.6 135.8,12.6 177,53.8 IC3.13 | 112.4,12.6 RTC.2 | 112.4,12.6 112.4,8.4 I2C1.3 | 30,73 66.8,73 75.4,64.4 90,64.4 91.6,66.4 92.4,67.2 96.2,67.2 96.2,58.8 98.6,56.4 98.6,27.4 91.6,20.4 91.6,16.6 EEPROM.5
  Bottom 0.254: EEPROM.5 91.6,16.6 92.6,17.6 109.6,17.6 112.4,14.8 RTC.2
VDD
  Top 0.635: 167,54 IC3.9 | IC1.14 89.4,55.4 87,57.8 87,59.6 C9.2 | SV5.4 154.2,74.2 154.2,71.8 SV5.3 154,71.8 152.4,70.2 139.2,70.2 139,70 | 139,70 137.6,71.4 KEYB.5 | 139,70 139,65 138,64 KEY.1 137.8,63.8 137.8,60.4 141.6,56.6 C7.2 141.6,56.2 139.4,54 139.4,34.8 135.2,30.6 134.8,30.6 SD-CARD.2 | SPI-RAM*.8 75,9 75,11.4 SPI-RAM*.7 75.2,11.6 77,13.4 77,20.4 77.4,20.8 C4.2 | 93.8,18 93.8,20.8 C5.2 | 93.8,18 93.8,11.2 91.6,9 EEPROM.8 | I2C1.1 107.4,8.4 108.2,9.2 108.2,12.6 109.8,14.2 109.8,14.6 RTC.3 110,14.8 110,18 | 110,18 110,27.8 129.4,27.8 SD-CARD1.3 | 110,18 93.8,18 | R12*.2 55.2,19.8 51.6,16.2 51.6,16 FRAM.1 | R11.1 36,21 33.8,23.2 33.8,24 R10.1 | SV1.4 21.2,74.4 23.4,76.6 38.8,76.6 38.8,74.4 SV1.18 | 3,3V.1 5.2,29.2 12,29.2 C6.1 12.2,29 17,24.2 17,21.6 C1.+ 17.2,21.4 18.8,19.8 18.8,10.2 18.4,10 PS/2.4
  Bottom 0.635: R13.2 184,51.8 169,51.8 167,53.8 IC3.9 166.8,54.2 166.8,56 141.6,56 C7.2 141.6,56.4 140.8,55.6 89.8,55.6 89.6,55.4 IC1.14 | SPI-RAM*.8 75,8.8 76.4,7.4 90,7.4 91.4,8.8 EEPROM.8 | SD-CARD1.3 130.6,29 132.8,29 134.2,30.4 134.6,30.4 SD-CARD.2 | 30.4,24 28,21.6 C8.+ 27.8,21.4 17.2,21.4 C1.+ | 30.4,24 33.6,24 R10.1 | U$3.1 26.2,28.4 30.4,24.2 30.4,24 | R11.1 36.2,20.8 37.6,19.4 54.8,19.4 55.2,19.8 R12*.2 55.4,20.2 56.6,21.4 77,21.4 77.4,21 C4.2 | SV1.4 21,74.4 19.6,75.8 18,75.8 1.6,59.4 1.6,29.4 5,29.4 3,3V.1
VSS  (via drill 0.6)
  other vias: 34.4,12.4 51.8,21.6 66.6,25.8
  pour Bottom: 1.27,8 1.27,71 arc-90 8,79 182,79 arc-90 189,71 189,7 arc-90 181.05,1.27 8,1.27 arc-90
  pour Top: 1.27,8 1.27,71 arc-90 8,79 182,79 arc-90 189,71 189,7 arc-90 181,1.27 8,1.27 arc-90

### Text on the board
tNames: GND | Zille-Soft | GND | 5V | GND | GND | 3,3V | + | 3,3V | 5V | - | CS | CS | MOSI | MOSI | SCK | SCK | GND | 3,3V | SDA | SCL | MISO | MISO | IO0 | IO27 | ESP32-Pocket | V1.0 03/2024 | GND | CLK | DAT | VCC | CS | MOSI | MISO | SCK | GND | 3,3V | 3,3V | SCL | SDA | GND